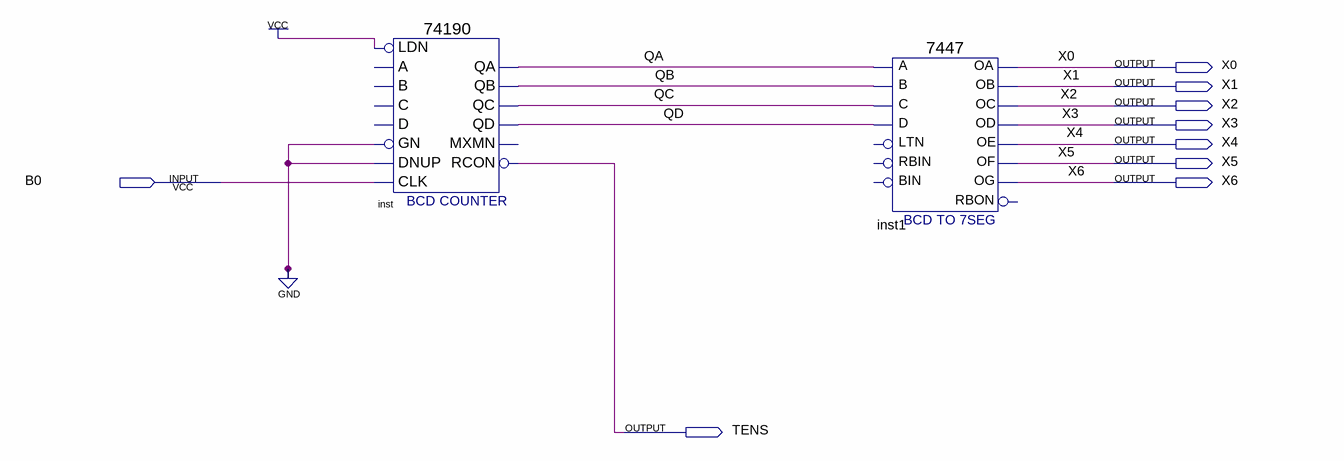
[diagram p0: schematic sheet]
// Quartus schematic ones_counter.bdf as structural Verilog: 2 symbols, 9 pins
module ones_counter (
  input  B0,
  output X0,
  output X1,
  output X2,
  output X3,
  output X4,
  output X5,
  output X6,
  output TENS
);

  wire QA, QB, QC, QD;

  \74190  inst (
    .LDN(1'b1), .GN(1'b0), .CLK(B0), .DNUP(1'b0), .QA(QA), .QB(QB), .QD(QD), .QC(QC), .RCON(TENS));  // open: A, C, B, D, MXMN
  \7447  inst1 (
    .B(QB), .C(QC), .D(QD), .A(QA), .OB(X1), .OC(X2), .OE(X4), .OD(X3), .OF(X5), .OG(X6), .OA(X0));  // open: LTN, RBIN, BIN, RBON
endmodule
